# Altium schematic sheet MY_AVR.SchDoc
size A; SheetNumber: 1; SheetTotal: 2
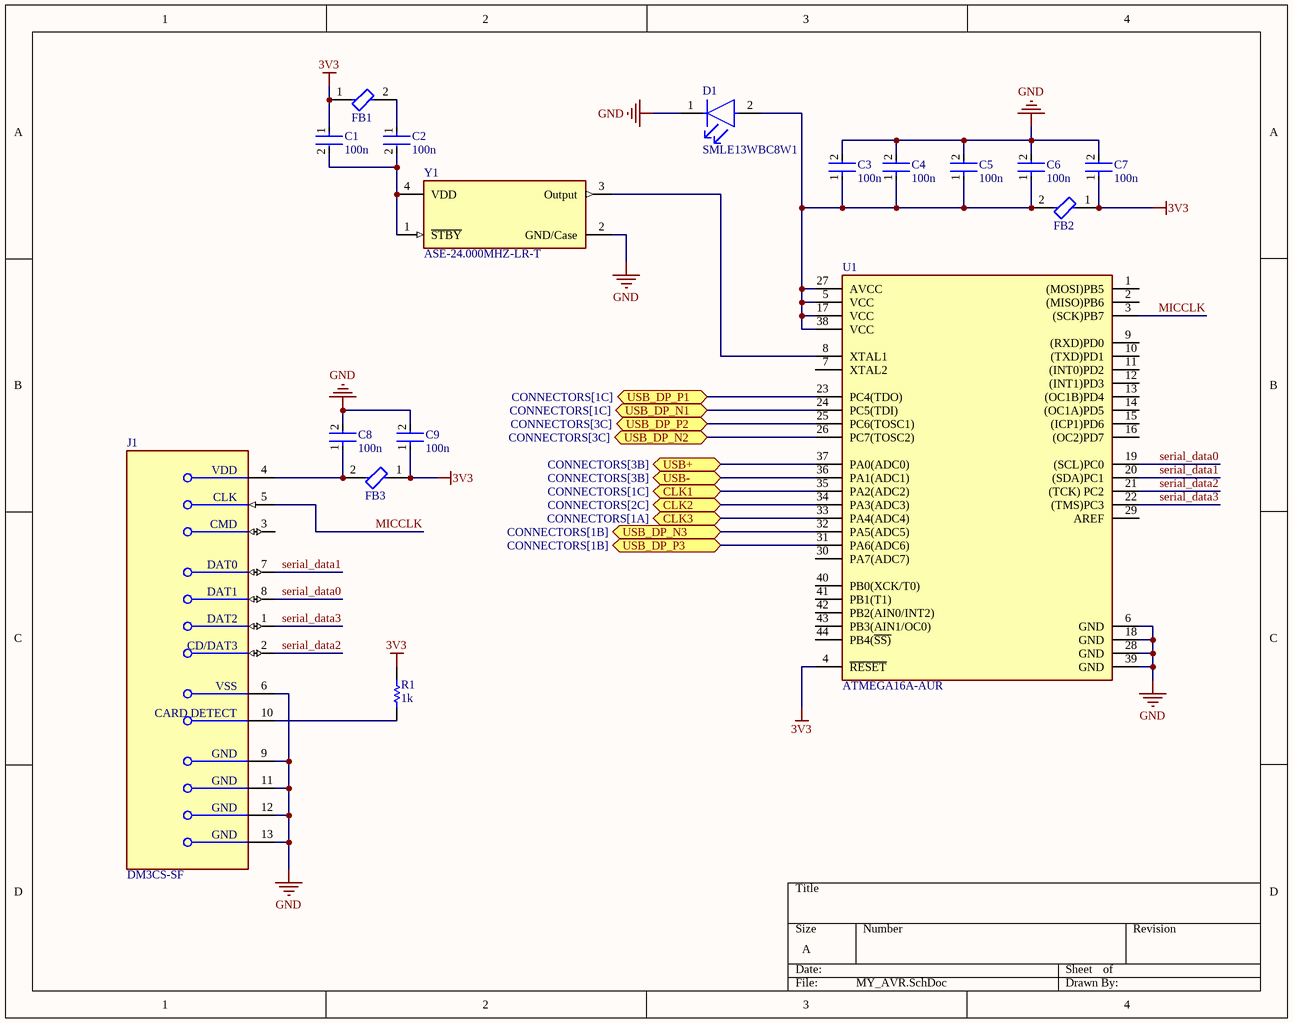
[diagram p0: MY_AVR.SchDoc]

## Parts
C1  100n  [FP-CL10-IPC_C]
C2  100n  [FP-CL10-IPC_C]
C3  100n  [FP-CL10-IPC_C]
C4  100n  [FP-CL10-IPC_C]
C5  100n  [FP-CL10-IPC_C]
C6  100n  [FP-CL10-IPC_C]
C7  100n  [FP-CL10-IPC_C]
C8  100n  [FP-CL10-IPC_C]
C9  100n  [FP-CL10-IPC_C]
D1  SMLE13WBC8W1  [FP-SMLE13WBC8W1-MFG]
FB1  BLM18KG121TN1D  [FP-BLM18-0_15-t0_6-d1_2-IPC_A]  (value not drawn)
FB2  BLM18KG121TN1D  [FP-BLM18-0_15-t0_6-d1_2-IPC_A]  (value not drawn)
FB3  BLM18KG121TN1D  [FP-BLM18-0_15-t0_6-d1_2-IPC_A]  (value not drawn)
J1  DM3CS-SF  [FP-DM3CS-SF-MFG]
R1  1k  [RESC2013X60X35ML10T20]
U1  ATMEGA16A-AUR  [FP-44A-MFG]
Y1  ASE-24.000MHZ-LR-T  [FP-ASE-MFG]

## Ports
CLK1 (bidir, see CONNECTORS[1C]), CLK2 (bidir, see CONNECTORS[2C]), CLK3 (bidir, see CONNECTORS[1A]), USB+ (bidir, see CONNECTORS[3B]), USB- (bidir, see CONNECTORS[3B]), USB_DP_N1 (bidir, see CONNECTORS[1C]), USB_DP_N2 (bidir, see CONNECTORS[3C]), USB_DP_N3 (bidir, see CONNECTORS[1B]), USB_DP_P1 (bidir, see CONNECTORS[1C]), USB_DP_P2 (bidir, see CONNECTORS[3C]), USB_DP_P3 (bidir, see CONNECTORS[1B])

## Nets
3V3: C1.1 C7.1 C9.1 FB1.1 FB2.1 FB3.1 R1.1 U1.4(~{RESET})
GND: C3.2 C4.2 C5.2 C6.2 C7.2 C8.2 C9.2 D1.1(C) J1.6(VSS) J1.9(GND) J1.11(GND) J1.12(GND) J1.13(GND) U1.6(GND) U1.18(GND) U1.28(GND) U1.39(GND) Y1.2(GND/Case)
CLK1: U1.35(PA2(ADC2)) ; port CLK1
CLK2: U1.34(PA3(ADC3)) ; port CLK2
CLK3: U1.33(PA4(ADC4)) ; port CLK3
MICCLK: J1.5(CLK) U1.3((SCK)PB7)
serial_data0: J1.8(DAT1) U1.19((SCL)PC0)
serial_data1: J1.7(DAT0) U1.20((SDA)PC1)
serial_data2: J1.2(CD/DAT3) U1.21((TCK)_PC2)
serial_data3: J1.1(DAT2) U1.22((TMS)PC3)
USB+: U1.37(PA0(ADC0)) ; port USB+
USB-: U1.36(PA1(ADC1)) ; port USB-
USB_DP_N1: U1.24(PC5(TDI)) ; port USB_DP_N1
USB_DP_N2: U1.26(PC7(TOSC2)) ; port USB_DP_N2
USB_DP_N3: U1.32(PA5(ADC5)) ; port USB_DP_N3
USB_DP_P1: U1.23(PC4(TDO)) ; port USB_DP_P1
USB_DP_P2: U1.25(PC6(TOSC1)) ; port USB_DP_P2
USB_DP_P3: U1.31(PA6(ADC6)) ; port USB_DP_P3
NetC1_2: C1.2 C2.2 Y1.1(~{STBY}) Y1.4(VDD)
NetC2_1: C2.1 FB1.2
NetC3_1: C3.1 C4.1 C5.1 C6.1 D1.2(A) FB2.2 U1.5(VCC) U1.17(VCC) U1.27(AVCC) U1.38(VCC)
NetC8_1: C8.1 FB3.2 J1.4(VDD)
NetJ1_10: J1.10(CARD_DETECT) R1.2
NetU1_8: U1.8(XTAL1) Y1.3(Output)

Not connected (* = marked no-connect by the designer): J1 3(CMD); U1 1((MOSI)PB5) 2((MISO)PB6) 7(XTAL2) 9((RXD)PD0) 10((TXD)PD1) 11((INT0)PD2) 12((INT1)PD3) 13((OC1B)PD4) 14((OC1A)PD5) 15((ICP1)PD6) 16((OC2)PD7) 29(AREF) 30(PA7(ADC7)) 40(PB0(XCK/T0)) 41(PB1(T1)) 42(PB2(AIN0/INT2)) 43(PB3(AIN1/OC0)) 44(PB4(~{SS)})

## Library data of the parts
C1-C9 = CMP-13271-003017-1: Cap Ceramic 4.7uF 10V X5R ±10% Pad SMD 0603 +85°C T/R; Capacitance: 4.7uF; Case/Package: 0603; Packaging: Tape and Reel; Width: 0.031inch; Contact Plating: Tin; Thickness: 0.035inch; Package Quantity: 1; Voltage Rating: 10V; Case Code (Metric): 1608; Case Code (Imperial): 0603; Depth: 0.8mm; Height: 0.8mm; Tolerance: 10%; Max Operating Temperature: 85°C; Length: 1.6mm; Dielectric: X5R; Mount: Surface Mount; Radiation Hardening: No; Min Operating Temperature: -55°C
D1 = CMP-08952-000004-1: LED WHITE 0603 SMD; Manufacturer: Rohm; Luminous Intensity: 140mcd; Led Orientation: Top View; Reverse Voltage: 5V; Forward Voltage: 2.9V; Forward Current: 5mA; Power Dissipation: 66mW; Temperature Range Low: -40°C; Digikey Description: LED WHITE 0603 SMD; Temperature Range High: +85°C; Temperature: -40°C to +85°C; Manufacturer Part Number: SMLE13WBC8W1; Colour: White; Mouser Description: Standard LEDs - SMD ExceLED White LED 120mcd 5mA; Octopart: https://octopart.com/smle13wbc8w1-rohm-22224565; Automotive: No; Device Class L2: LEDs; Lead Free: Yes; ComponentLink2URL: https://media.digikey.com/pdf/Data%20Sheets/Rohm%20PDFs/SMLE13WBC8W1_Spec.pdf; Device Class L3: unset; Package: 0; RoHS: TRUE; Height: 0.4mm; Category: Diode; Device Class L1: Optoelectronics; ComponentLink2Description: Datasheet
FB1-FB3 = CMP-0686-00554-8: FERRITE BEAD 120 OHM 0603 1LN; Max Current Rating: 3A; DC Resistance (DCR): 30mR; Impedance: 120R; Number of Lines: 1; Test Frequency: 100MHz; Tolerance: 25%; Package Quantity: 4000; Min Operating Temperature: -55°C; Termination: SMD/SMT; REACH SVHC: No SVHC; Core Material: Ferrite; Material: Ferrite; Current Rating: 3A; Height: 0.8mm; Number of Pins: 2; Case/Package: 0603; Case Code (Imperial): 0603; Series: BLM18K; Packaging: Tape and Reel; Inductor Type: FERRITE BEAD; Lead Free: Lead Free; Width: 0.8mm; Case Code (Metric): 1608; Number of Circuits: 1; Max DC Current: 3A; Depth: 0.95mm; Max Operating Temperature: 125°C; Length: 1.6mm; RoHS Compliant: Yes
J1 = CMP-11597-000003-1: CONN MICRO SD CARD HINGED TYPE; Pitch: 1.1mm; Connector Type: Connector; Current Rating: 500mA; Voltage Rating (AC): 125V; Gender: Female; Insulation Resistance: 1GR; Number of Positions: 8; Contact Resistance: 100mR; Packaging: Tape and Reel; Flammability Rating: UL94 V-0; Lead Free: Lead Free; Min Operating Temperature: -25°C; Orientation: Right Angle; Width: 13.8mm; Number of Rows: 1; Housing Material: Polymer; Package Quantity: 1; Mount: Surface Mount; Max Current Rating: 500mA; Radiation Hardening: No; Max Operating Temperature: 85°C; Contact Plating: Gold; Depth: 1.83mm; Contact Material: Gold; Length: 14.1mm; Number of Contacts: 8; Termination: Solder
R1 = CMP-2100-03673-1: Chip Resistor, 0 Ohm, Jumper, +/- 5%, 0.125 W, -55 to 155 degC, 0805 (2012 Metric), RoHS, Tape and Reel; Manufacturer: Yageo; Power Rating: 125mW; Resistance: 0mOhm; Voltage Rating (DC): 150V; Temperature Coefficient: 200ppm/degreesC; Height: 0.5mm; Depth: 1.25mm; Case Code (Imperial): 0805; Lead Free: LeadFree; Military Standard: Not; Package Description: 2-Pin Surface Mounted Device, Body 2 x 1.25 mm; Case Code (Metric): 2012; Composition: ThickFilm; Voltage Rating: 150V; Manufacturer URL: http://www.yageo.com/; Packaging: TapeandReel; Package Reference: 0805; REACH SVHC: Unknown; Tolerance: 5%; Case/Package: 0805; Max Operating Temperature: 155degC; Number of Pins: 2; Min Operating Temperature: -55degC; RoHSCompliant: true; Length: 2mm; Datasheet URL: http://www.yageo.com/NewPortal/yageodocoutput?fileName=/pdf/R-Chip/PYu-RC_Group_51_RoHS_L_5.pdf; Termination: SMD/SMT; Radiation Hardening: No; Width: 1.25mm; Contact Plating: Tin; Datasheet Version: Rev. 5, 10/2016
U1 = CMP-06276-000100-1: IC MCU 8BIT 16KB FLASH 44TQFP; Core Architecture: PIC; Number of I/Os: 13; Peripherals: Brown-out Detect/Reset; Oscillator Type: External; Frequency: 4MHz; Memory Size: 896B; Memory Type: OTP; Case/Package: DIP; Packaging: Rail/Tube; Max Operating Temperature: 70°C; RoHS Compliant: Yes; Min Operating Temperature: 0°C; Series: PIC® 16C
Y1 = CMP-27762-001392-1: XTAL Oscillator 24MHz ±25ppm CMOS 3.3V 4-SMD 3.2mm x 2.5mm; Max Supply Current: 13mA; Load Capacitance: 15pF; Packaging: Tape and Reel; Case/Package: SMD/SMT; Number of Pins: 4; Max Operating Temperature: 85°C; Min Operating Temperature: -40°C; Package Quantity: 1000; Operating Supply Voltage: 3.3V; Lead Free: Lead Free; Height: 0.047inch; Frequency Stability: 25ppm; Series: ASE; Frequency: 24MHz; Length: 0.126inch; Width: 0.098inch; Mount: Surface Mount